# Altium schematic sheet Real Time Clock.SchDoc
size A4; SheetNumber: 8; SheetTotal: 11; TitleBlk1Sch: PCBA, LUCHADOR, REV 3.2b, AMBER; EngDate: 3-15-19; Eng: Haman; RevSch: 01; TitleBlk2Sch: Real Time Clock
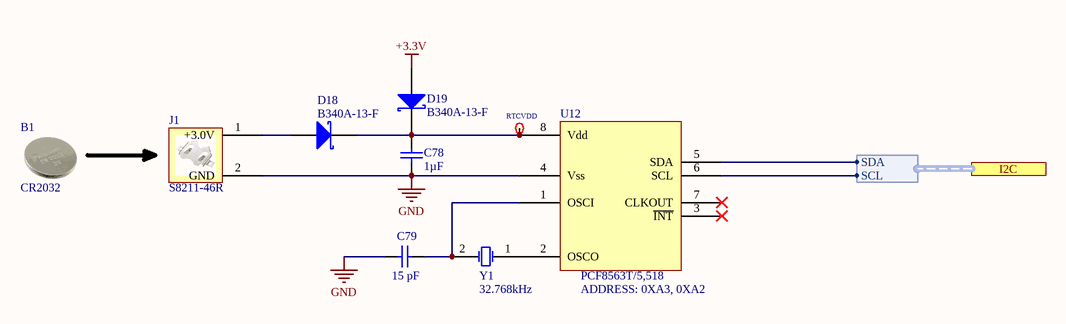
[diagram p0: Real Time Clock.SchDoc]

## Parts
B1  CR2032  (mechanical)
C78  Capacitance: 1µF  [0402C]  (hidden comment: 50V)
C79  Capacitance: 15 pF  [0402C]  (hidden comment: 50V)
D18  Manufacturer Part Number: B340A-13-F  [SMA]  (hidden comment: BAT46ZFILM)
D19  Manufacturer Part Number: B340A-13-F  [SMA]  (hidden comment: BAT46ZFILM)
J1  S8211-46R  [CR2032 ASSEMBLY]
RTCVDD  5001  [KEYSTONE TP]  (value not drawn)  (no BOM)
U12  PCF8563T/5,518  ADDRESS: 0XA3, 0XA2  [SO-8]
Y1  32.768kHz  [ABS10]

## Ports
I2C (harness I2C)

## Harnesses
I2C: SDA, SCL

## Nets
+3.3V: D19.1(A)
GND: C78.2 C79.1 J1.2(GND) U12.4(Vss)
NetC78_1: C78.1 D18.2(K) D19.2(K) RTCVDD.1 U12.8(Vdd)
NetC79_2: C79.2 U12.1(OSCI) Y1.2(OSC2)
NetD18_1: D18.1(A) J1.1(+3.0V)
NetU12_2: U12.2(OSCO) Y1.1(OSC1)
NetU12_5: U12.5(SDA) ; port I2C.SDA
NetU12_6: U12.6(SCL) ; port I2C.SCL

Not connected (* = marked no-connect by the designer): U12 3(~{INT})* 7(CLKOUT)*

## Notes on the sheet
- Title:
- USA
- 100 Mayfield Avenue
- Mountain View, CA 94043
- Variant Name:
- Confidential and Proprietary
- Engineer:
- Date:
- Size:
- A4
- Template:
- 992-00283-00 A
- Dwg No:
- Sheet:
- Rev:
- of

## Library data of the parts
B1 = CR2032: Manufacturer: Panasonic - BSG; Description 1: BATTERY LITHIUM COIN 3V 20MM; Battery Chemistry: Lithium; Battery Cell Size: Coin, 20.0mm; Voltage - Rated: 3V; Capacity: 225mAh; Discharge Rate: 200µA; Shipping Info: Due to possible restrictions, a change in ship method may be required.; Supplier 1: Digi-Key; Supplier Part Number 1: P189-ND; Manufacturer Part Number: CR2032; RoHS: RoHS Compliant By Exemption; Category: Battery Products; Stock 1: 2168228; Pricing 1: 1=0.28, 10=0.248, 50=0.22, 100=0.1925, 250=0.176, 500=0.165, 1000=0.15125, 2500=0.14025, 5000=0.1375 (USD); Size / Dimension: 0.79" Dia x 0.13" H (20.0mm x 3.2mm); Termination Style: Requires Holder; Weight: 0.1 oz (2.85g); ComponentLink1URL: http://panasonic.com/industrial/includes/pdf/Panasonic_Lithium_CR2032_CR2330.pdf; ComponentLink1Description: http://panasonic.com/industrial/includes/pdf/Panasonic_Lithium_CR2032_CR2330.pdf
C78 = Cap: CAP .1UF 50V CERAMIC Y5V 0805; Manufacturer: TDK; Manufacturer Part Number: CGB2A1JB1C105K033BC; PCN Part Number: MLCC Part Number Change 30/Nov/2012; Description1: 1µF ±10% 16V JB Ceramic Capacitor -25°C ~ 85°C Surface Mount, MLCC 0402 (1005 Metric) 0.039" L x 0.020" W (1.00mm x 0.50mm); Product Training Modules: SEAT, CCV, and TVCL Design Tools Guide to Replacing an Electrolytic Capacitor with an MLCC; Featured Product: CGB Series Capacitors CH and JB Temperature Coefficient Capacitors; EDA / CAD Models: Download from Accelerated Designs; Tolerance: ±10%; Voltage - Rated: 16V; Temperature Coefficient: JB; Online Catalog: CGB Series; Other Names: 445-12011-6; Revision: July-2002: Re-released for DXP Platform.; Supplier 1: Digi-Key; Supplier Part Number 1: 445-12011-1-ND; Stock 1: 7430; Pricing 1: 1=0.22, 10=0.151, 100=0.0765, 500=0.0523, 1000=0.0463, 2500=0.0443, 5000=0.0403 (USD); RoHS Information: RoHS Certificate-MLCC; Standard Package: 1; Category: Capacitors; Family: Ceramic Capacitors; Series: CGB; Packaging: Digi-Reel®; Mounting Type: Surface Mount, MLCC; Operating Temperature: -25°C ~ 85°C; Applications: General Purpose; Package / Case: 0402 (1005 Metric); Size / Dimension: 0.039" L x 0.020" W (1.00mm x 0.50mm); Thickness (Max): 0.013" (0.33mm); Features: Low Profile; ComponentLink1URL: https://product.tdk.com/info/en/catalog/datasheets/mlcc_commercial_lowprofile_en.pdf; ComponentLink1Description: https://product.tdk.com/info/en/catalog/datasheets/mlcc_commercial_lowprofile_en.pdf; ComponentLink2URL: https://product.tdk.com/info/en/catalog/spec/mlccspec_commercial_lowprofile_en.pdf; ComponentLink2Description: https://product.tdk.com/info/en/catalog/spec/mlccspec_commercial_lowprofile_en.pdf; ComponentLink3URL: http://product.tdk.com/en/catalog/datasheets/mlcc_commercial_lowprofile_en.pdf; ComponentLink3Description: http://product.tdk.com/en/catalog/datasheets/mlcc_commercial_lowprofile_en.pdf
C79 = Cap: CAP .1UF 50V CERAMIC Y5V 0805; Manufacturer: Johanson; Manufacturer Part Number: 500R07N150JV4T; Description1: Cap Ceramic 15pF 50V C0G 5% SMD 0402 125C Paper T/R; Voltage Rating DC: 50 VDC; Dielectric: C0G (NP0); Tolerance: 5 %; Brand: Johanson Dielectrics; Type: Surface Mount MLCC; Revision: July-2002: Re-released for DXP Platform.; Supplier 1: Digi-Key; Supplier Part Number 1: 709-1118-1-ND; Stock 1: 100000; Pricing 1: 1=0.14, 10=0.103, 100=0.0458, 500=0.0327, 1000=0.0257, 2500=0.0233, 5000=0.0215 (USD); Product Category: Multilayer Ceramic Capacitors MLCC - SMD/SMT; RoHS: Details; Maximum Operating Temperature: + 125 C; Minimum Operating Temperature: - 55 C; Product: General Type MLCCs; Packaging: Reel; Factory Pack Quantity: 10000; ComponentLink1URL: https://datasheet.ciiva.com/26934/getdatasheetpartid-85139-26934162.pdf; ComponentLink1Description: https://datasheet.ciiva.com/26934/getdatasheetpartid-85139-26934162.pdf
D18 D19 = BAT46ZFILM: Schottky Rectifier; Manufacturer: Diodes Incorporated; Description1: DIODE SCHOTTKY 40V 3A SMA; Voltage - DC Reverse (Vr) (Max): 40V; Current - Average Rectified (Io): 3A; Voltage - Forward (Vf) (Max) @ If: 500mV @ 3A; Speed: Fast Recovery =< 500ns, > 200mA (Io); Current - Reverse Leakage @ Vr: 500µA @ 40V; Capacitance @ Vr, F: 200pF @ 4V, 1MHz; Supplier 1: Digi-Key; Supplier Part Number 1: B340A-FDICT-ND; RoHS: RoHS Compliant; Category: Discrete Semiconductor Products; Stock 1: 304487; Pricing 1: 1=0.42, 10=0.339, 100=0.231, 500=0.1729, 1000=0.1295 (USD); Packaging: Cut Tape (CT); Part Status: Active; Diode Type: Schottky; Reverse Recovery Time (trr): -; Mounting Type: Surface Mount; Package / Case: DO-214AC, SMA; Supplier Device Package: SMA; Operating Temperature - Junction: -55°C ~ 150°C; ComponentLink1URL: http://www.diodes.com/_files/datasheets/ds30891.pdf; ComponentLink1Description: http://www.diodes.com/_files/datasheets/ds30891.pdf
J1 = S8211-46R: Manufacturer: Harwin Inc; Description 1: HOLDER BATT COIN CR2032/20MM; Battery Type, Function: Coin Cell, Retainer; Style: Retainer; Battery Cell Size: Coin, 20.0mm; Number of Cells: 1; Battery Series: 2016, 2020, 2025, 2032; Supplier 1: Digi-Key; Supplier Part Number 1: 952-1735-2-ND; Manufacturer Part Number: S8211-46R; RoHS: RoHS Compliant; Category: Battery Products; Stock 1: 550; Pricing 1: 550=0.4716, 1100=0.4192, 1650=0.3799, 2750=0.34846, 5500=0.3406, 13750=0.3275, 27500=0.32095, 55000=0.3144 (USD); Mounting Type: PCB, Surface Mount; Termination Style: SMD (SMT) Tab; Height Above Board: 0.157" (4mm); Operating Temperature: -; ComponentLink1URL: http://www.harwin.com/include/downloads/drawings/S8211R.PDF; ComponentLink1Description: http://www.harwin.com/include/downloads/drawings/S8211R.PDF
RTCVDD = 5001: Manufacturer: Keystone Electronics; Description1: TEST POINT PC MINI .040"D BLACK; Supplier 1: Digi-Key; Manufacturer Part Number: 5001; RoHS: RoHS Compliant; Category: Test and Measurement; Stock 1: 159085; Pricing 1: 1=0.34, 10=0.315, 50=0.2296, 100=0.2206, 250=0.19812, 500=0.1891, 1000=0.15759, 2500=0.14408, 5000=0.13508 (USD); Packaging: Bulk; Type: PC Test Point, Miniature; Terminal: 0.010" x 0.020" (0.25mm x 0.51mm) Phosphor Bronze Wire, Silver Plated; Mounting Type: 0.040" (1.02mm) Hole Diameter; Material: Base, Nylon 46, UL 94V-0; Color: Black; ComponentLink1URL: http://www.keyelco.com/product-pdf.cfm?p=1310; ComponentLink1Description: http://www.keyelco.com/product-pdf.cfm?p=1310; Supplier Part Number 1: 5001K-ND
U12 = PCF8563T/5,518: Manufacturer: NXP Semiconductors; Description 1: IC RTC/CALENDAR 8SOIC; Time Format: HH:MM:SS (24 hr); Date Format: YY-MM-DD-dd; Interface: I²C, 2-Wire Serial; Voltage - Supply: 1.8 V ~ 5.5 V; Voltage - Supply, Battery: 1 V ~ 5.5 V; Supplier 1: Digi-Key; Manufacturer Part Number: PCF8563T/5,518; RoHS: RoHS Compliant; Category: Integrated Circuits (ICs); Stock 1: 10000; Pricing 1: 2500=0.4704, 5000=0.44688, 12500=0.43008, 25000=0.41664, 62500=0.4032 (USD); Type: Clock/Calendar; Features: Alarm, Leap Year, Watchdog Timer; Memory Size: -; Operating Temperature: -40°C ~ 85°C; Mounting Type: Surface Mount; Package / Case: 8-SOIC (0.154", 3.90mm Width); Supplier Device Package: 8-SO; Packaging: Tape & Reel (TR); ComponentLink1URL: http://www.nxp.com/documents/data_sheet/PCF8563.pdf; ComponentLink1Description: http://www.nxp.com/documents/data_sheet/PCF8563.pdf; Supplier Part Number 1: 568-6650-2-ND
Y1 = XTAL: Crystal Oscillator; Manufacturer: Abracon Corporation; Manufacturer Part Number: ABS10-32.768KHZ-T; Description 1: CRYSTAL 32.768KHZ 12.5PF SMD; Frequency Tolerance: ±20ppm; Load Capacitance: 12.5pF; ESR (Equivalent Series Resistance): 70 kOhm; Operating Mode: Fundamental; Supplier 1: Digi-Key; Supplier Part Number 1: 535-9536-1-ND; RoHS: RoHS Compliant; Category: Crystals and Oscillators; Stock 1: 61959; Pricing 1: 1=1.13, 10=0.975, 50=0.855, 100=0.675, 500=0.57 (USD); Type: kHz Crystal (Tuning Fork); Frequency: 32.768kHz; Frequency Stability: -; Operating Temperature: -40°C ~ 85°C; Ratings: -; Mounting Type: Surface Mount; Package / Case: 2-SMD; Size / Dimension: 0.190" L x 0.070" W (4.90mm x 1.80mm); Height: 0.039" (1.00mm); Packaging: Cut Tape (CT); ComponentLink1URL: http://www.abracon.com/Resonators/ABS10.pdf; ComponentLink1Description: http://www.abracon.com/Resonators/ABS10.pdf